# Altium schematic sheet FPGA.SchDoc: Grandmaster FPGA Connectors
size Tabloid; Author: N Smith; Revision: A; SheetNumber: 6; SheetTotal: 6; Customer: 01910
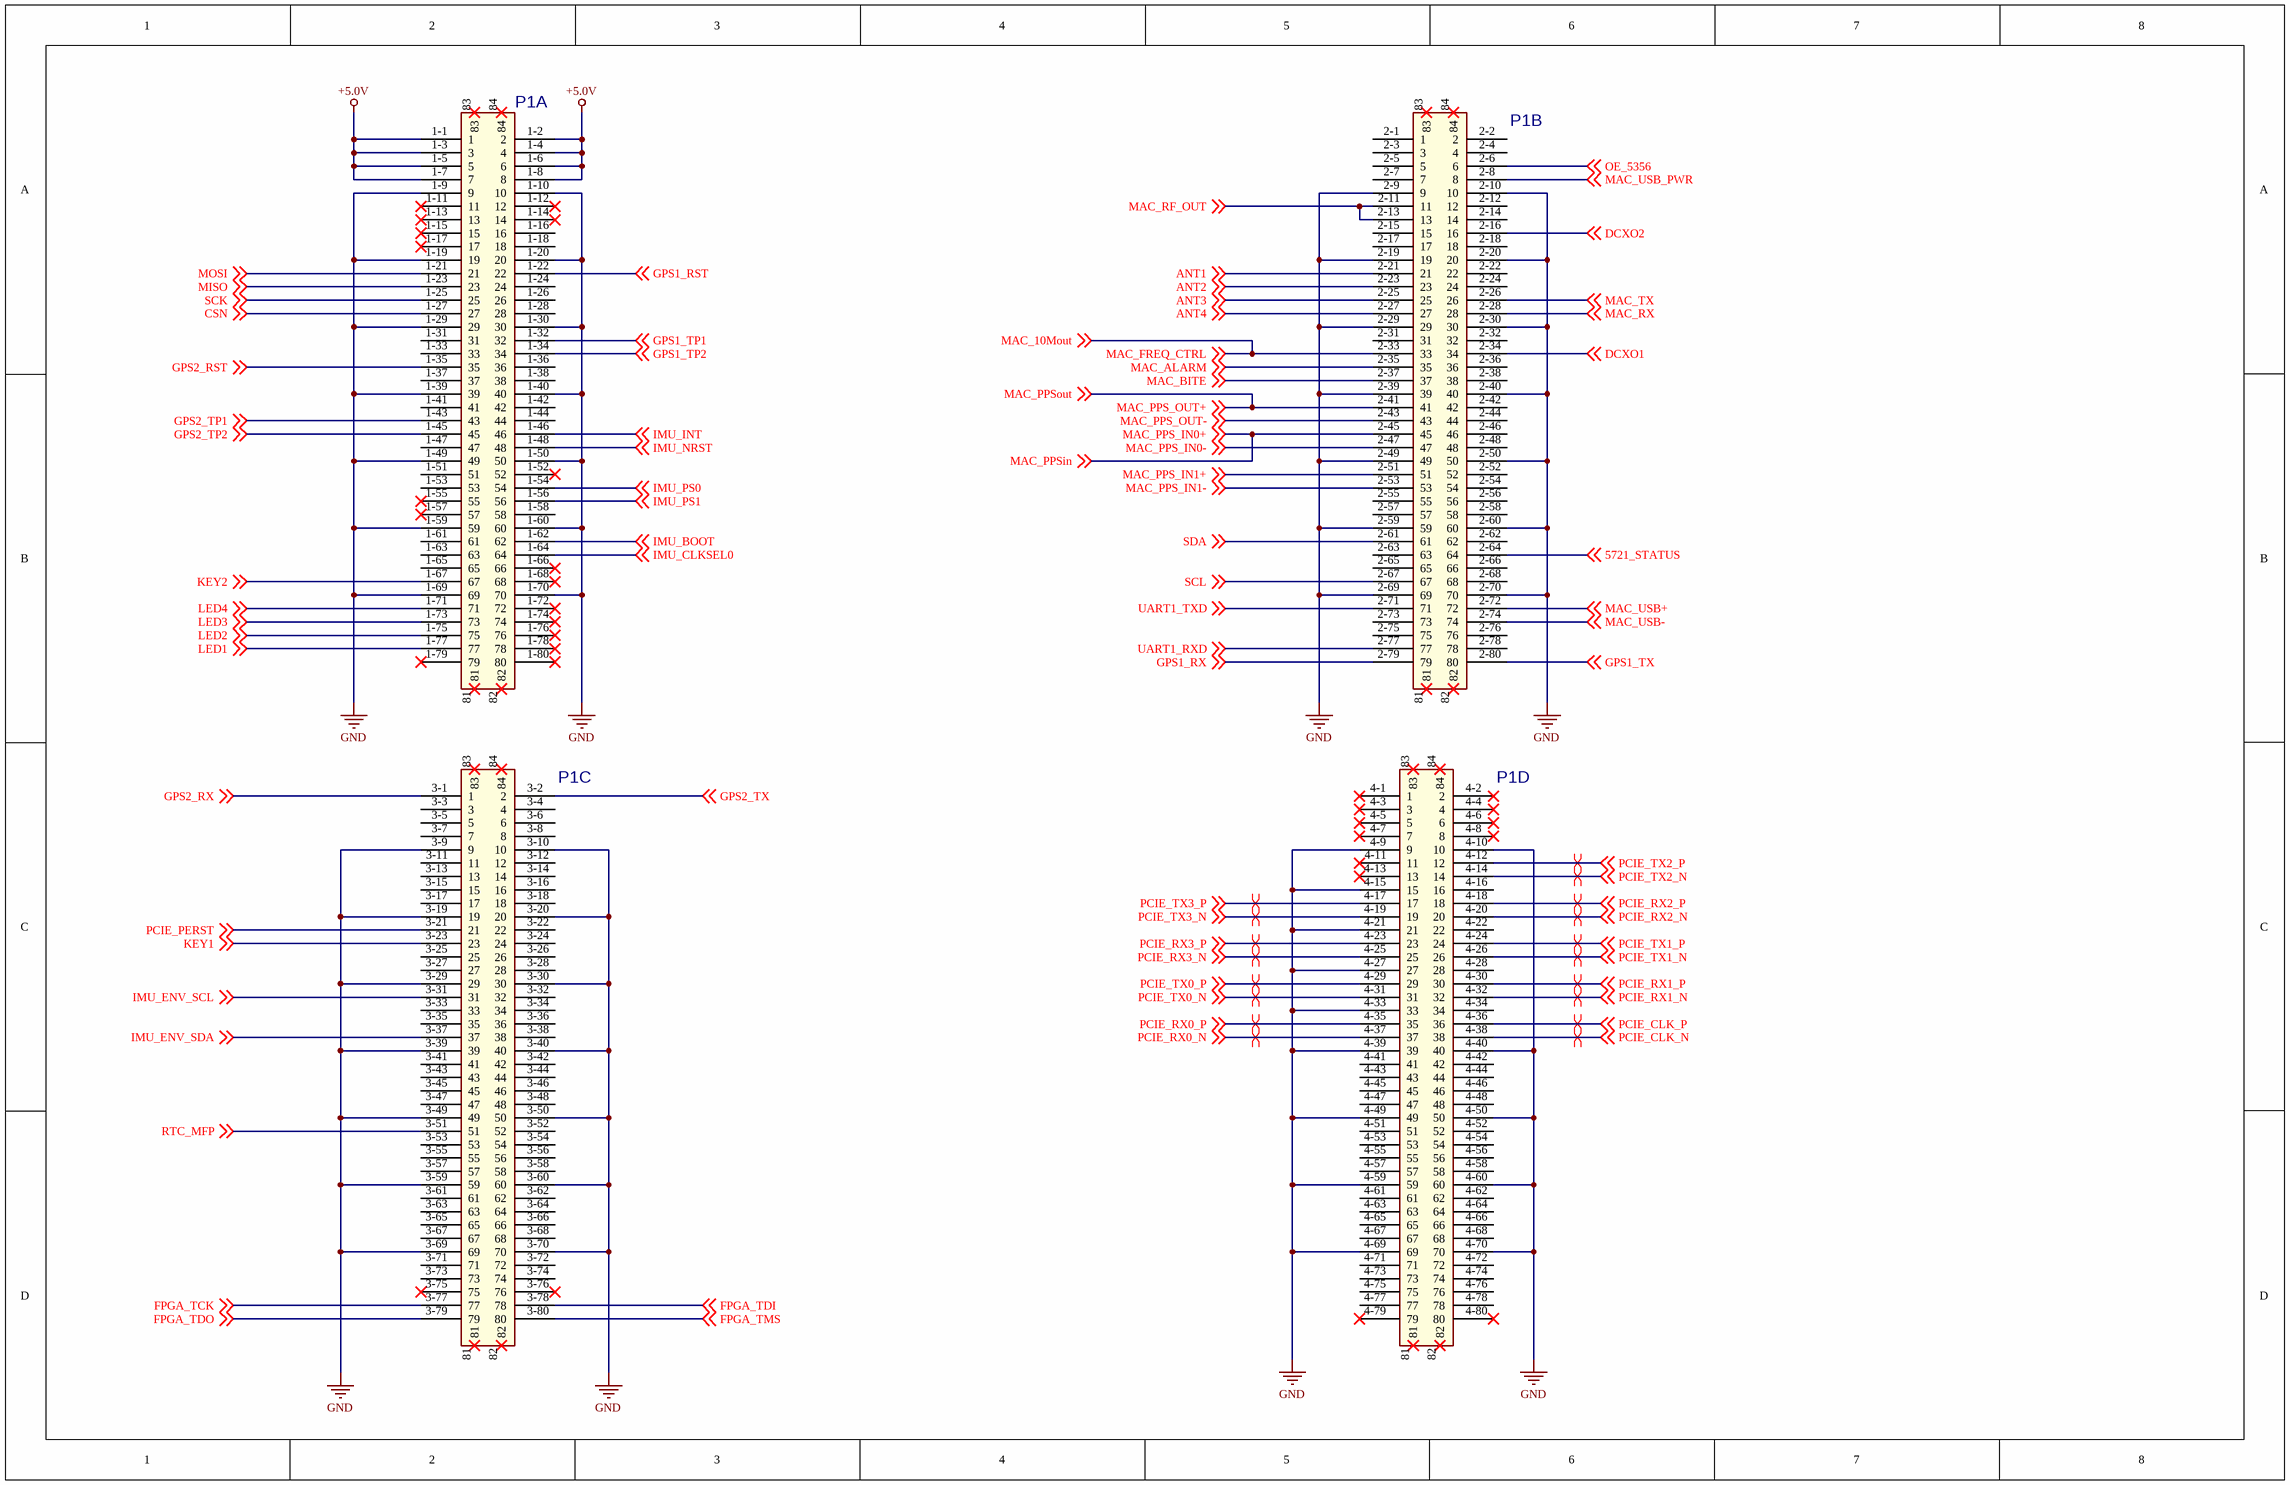
[diagram p0: FPGA.SchDoc]

## Parts
P1  MOD, FPGA, AC7100  [ALINX_FPGA]  (value not drawn)  (parts A,B,C,D of 4)

## Nets
+5.0V: P1.1-1(1) P1.1-2(2) P1.1-3(3) P1.1-4(4) P1.1-5(5) P1.1-6(6) P1.1-7(7) P1.1-8(8)
GND: P1.1-9(9) P1.1-10(10) P1.1-19(19) P1.1-20(20) P1.1-29(29) P1.1-30(30) P1.1-39(39) P1.1-40(40) P1.1-49(49) P1.1-50(50) P1.1-59(59) P1.1-60(60) P1.1-69(69) P1.1-70(70) P1.2-9(9) P1.2-10(10) P1.2-19(19) P1.2-20(20) P1.2-29(29) P1.2-30(30) P1.2-39(39) P1.2-40(40) P1.2-49(49) P1.2-50(50) P1.2-59(59) P1.2-60(60) P1.2-69(69) P1.2-70(70) P1.3-9(9) P1.3-10(10) P1.3-19(19) P1.3-20(20) P1.3-29(29) P1.3-30(30) P1.3-39(39) P1.3-40(40) P1.3-49(49) P1.3-50(50) P1.3-59(59) P1.3-60(60) P1.3-69(69) P1.3-70(70) P1.4-9(9) P1.4-10(10) P1.4-15(15) P1.4-21(21) P1.4-27(27) P1.4-33(33) P1.4-39(39) P1.4-40(40) P1.4-49(49) P1.4-50(50) P1.4-59(59) P1.4-60(60) P1.4-69(69) P1.4-70(70)
5721_STATUS: P1.2-64(64) ; off-sheet 5721_STATUS
ANT1: P1.2-21(21) ; off-sheet ANT1
ANT2: P1.2-23(23) ; off-sheet ANT2
ANT3: P1.2-25(25) ; off-sheet ANT3
ANT4: P1.2-27(27) ; off-sheet ANT4
CSN: P1.1-27(27) ; off-sheet CSN
DCXO1: P1.2-34(34) ; off-sheet DCXO1
DCXO2: P1.2-16(16) ; off-sheet DCXO2
FPGA_TCK: P1.3-77(77) ; off-sheet FPGA_TCK
FPGA_TDI: P1.3-78(78) ; off-sheet FPGA_TDI
FPGA_TDO: P1.3-79(79) ; off-sheet FPGA_TDO
FPGA_TMS: P1.3-80(80) ; off-sheet FPGA_TMS
GPS1_RST: P1.1-22(22) ; off-sheet GPS1_RST
GPS1_RX: P1.2-79(79) ; off-sheet GPS1_RX
GPS1_TP1: P1.1-32(32) ; off-sheet GPS1_TP1
GPS1_TP2: P1.1-34(34) ; off-sheet GPS1_TP2
GPS1_TX: P1.2-80(80) ; off-sheet GPS1_TX
GPS2_RST: P1.1-35(35) ; off-sheet GPS2_RST
GPS2_RX: P1.3-1(1) ; off-sheet GPS2_RX
GPS2_TP1: P1.1-43(43) ; off-sheet GPS2_TP1
GPS2_TP2: P1.1-45(45) ; off-sheet GPS2_TP2
GPS2_TX: P1.3-2(2) ; off-sheet GPS2_TX
IMU_BOOT: P1.1-62(62) ; off-sheet IMU_BOOT
IMU_CLKSEL0: P1.1-64(64) ; off-sheet IMU_CLKSEL0
IMU_ENV_SCL: P1.3-31(31) ; off-sheet IMU_ENV_SCL
IMU_ENV_SDA: P1.3-37(37) ; off-sheet IMU_ENV_SDA
IMU_INT: P1.1-46(46) ; off-sheet IMU_INT
IMU_NRST: P1.1-48(48) ; off-sheet IMU_NRST
IMU_PS0: P1.1-54(54) ; off-sheet IMU_PS0
IMU_PS1: P1.1-56(56) ; off-sheet IMU_PS1
KEY1: P1.3-23(23) ; off-sheet KEY1
KEY2: P1.1-67(67) ; off-sheet KEY2
LED1: P1.1-77(77) ; off-sheet LED1
LED2: P1.1-75(75) ; off-sheet LED2
LED3: P1.1-73(73) ; off-sheet LED3
LED4: P1.1-71(71) ; off-sheet LED4
MAC_10Mout: P1.2-33(33) ; off-sheet MAC_FREQ_CTRL, off-sheet MAC_10Mout  [also labelled MAC_FREQ_CTRL]
MAC_ALARM: P1.2-35(35) ; off-sheet MAC_ALARM
MAC_BITE: P1.2-37(37) ; off-sheet MAC_BITE
MAC_PPS_IN0+: P1.2-45(45) ; off-sheet MAC_PPS_IN0+, off-sheet MAC_PPSin  [also labelled MAC_PPSin]
MAC_PPS_IN0-: P1.2-47(47) ; off-sheet MAC_PPS_IN0-
MAC_PPS_IN1+: P1.2-51(51) ; off-sheet MAC_PPS_IN1+
MAC_PPS_IN1-: P1.2-53(53) ; off-sheet MAC_PPS_IN1-
MAC_PPS_OUT+: P1.2-41(41) ; off-sheet MAC_PPS_OUT+, off-sheet MAC_PPSout  [also labelled MAC_PPSout]
MAC_PPS_OUT-: P1.2-43(43) ; off-sheet MAC_PPS_OUT-
MAC_RF_OUT: P1.2-11(11) P1.2-13(13) ; off-sheet MAC_RF_OUT
MAC_RX: P1.2-28(28) ; off-sheet MAC_RX
MAC_TX: P1.2-26(26) ; off-sheet MAC_TX
MAC_USB+: P1.2-72(72) ; off-sheet MAC_USB+
MAC_USB-: P1.2-74(74) ; off-sheet MAC_USB-
MAC_USB_PWR: P1.2-8(8) ; off-sheet MAC_USB_PWR
MISO: P1.1-23(23) ; off-sheet MISO
MOSI: P1.1-21(21) ; off-sheet MOSI
OE_5356: P1.2-6(6) ; off-sheet OE_5356
PCIE_CLK_N: P1.4-38(38) ; off-sheet PCIE_CLK_N
PCIE_CLK_P: P1.4-36(36) ; off-sheet PCIE_CLK_P
PCIE_PERST: P1.3-21(21) ; off-sheet PCIE_PERST
PCIE_RX0_N: P1.4-37(37) ; off-sheet PCIE_RX0_N
PCIE_RX0_P: P1.4-35(35) ; off-sheet PCIE_RX0_P
PCIE_RX1_N: P1.4-32(32) ; off-sheet PCIE_RX1_N
PCIE_RX1_P: P1.4-30(30) ; off-sheet PCIE_RX1_P
PCIE_RX2_N: P1.4-20(20) ; off-sheet PCIE_RX2_N
PCIE_RX2_P: P1.4-18(18) ; off-sheet PCIE_RX2_P
PCIE_RX3_N: P1.4-25(25) ; off-sheet PCIE_RX3_N
PCIE_RX3_P: P1.4-23(23) ; off-sheet PCIE_RX3_P
PCIE_TX0_N: P1.4-31(31) ; off-sheet PCIE_TX0_N
PCIE_TX0_P: P1.4-29(29) ; off-sheet PCIE_TX0_P
PCIE_TX1_N: P1.4-26(26) ; off-sheet PCIE_TX1_N
PCIE_TX1_P: P1.4-24(24) ; off-sheet PCIE_TX1_P
PCIE_TX2_N: P1.4-14(14) ; off-sheet PCIE_TX2_N
PCIE_TX2_P: P1.4-12(12) ; off-sheet PCIE_TX2_P
PCIE_TX3_N: P1.4-19(19) ; off-sheet PCIE_TX3_N
PCIE_TX3_P: P1.4-17(17) ; off-sheet PCIE_TX3_P
RTC_MFP: P1.3-51(51) ; off-sheet RTC_MFP
SCK: P1.1-25(25) ; off-sheet SCK
SCL: P1.2-67(67) ; off-sheet SCL
SDA: P1.2-61(61) ; off-sheet SDA
UART1_RXD: P1.2-77(77) ; off-sheet UART1_RXD
UART1_TXD: P1.2-71(71) ; off-sheet UART1_TXD

Not connected (* = marked no-connect by the designer): P1 1-11(11)* 1-12(12)* 1-13(13)* 1-14(14)* 1-15(15)* 1-16(16) 1-17(17)* 1-18(18) 1-24(24) 1-26(26) 1-28(28) 1-31(31) 1-33(33) 1-36(36) 1-37(37) 1-38(38) 1-41(41) 1-42(42) 1-44(44) 1-47(47) 1-51(51) 1-52(52)* 1-53(53) 1-55(55)* 1-57(57)* 1-58(58) 1-61(61) 1-63(63) 1-65(65) 1-66(66)* 1-68(68)* 1-72(72)* 1-74(74)* 1-76(76)* 1-78(78)* 1-79(79)* 1-80(80)* 2-1(1) 2-2(2) 2-3(3) 2-4(4) 2-5(5) 2-7(7) 2-12(12) 2-14(14) 2-15(15) 2-17(17) 2-18(18) 2-22(22) 2-24(24) 2-31(31) 2-32(32) 2-36(36) 2-38(38) 2-42(42) 2-44(44) 2-46(46) 2-48(48) 2-52(52) 2-54(54) 2-55(55) 2-56(56) 2-57(57) 2-58(58) 2-62(62) 2-63(63) 2-65(65) 2-66(66) 2-68(68) 2-73(73) 2-75(75) 2-76(76) 2-78(78) 3-3(3) 3-4(4) 3-5(5) 3-6(6) 3-7(7) 3-8(8) 3-11(11) 3-12(12) 3-13(13) 3-14(14) 3-15(15) 3-16(16) 3-17(17) 3-18(18) 3-22(22) 3-24(24) 3-25(25) 3-26(26) 3-27(27) 3-28(28) 3-32(32) 3-33(33) 3-34(34) 3-35(35) 3-36(36) 3-38(38) 3-41(41) 3-42(42) 3-43(43) 3-44(44) 3-45(45) 3-46(46) 3-47(47) 3-48(48) 3-52(52) 3-53(53) 3-54(54) 3-55(55) 3-56(56) 3-57(57) 3-58(58) 3-61(61) 3-62(62) 3-63(63) 3-64(64) 3-65(65) 3-66(66) 3-67(67) 3-68(68) 3-71(71) 3-72(72) 3-73(73) 3-74(74) 3-75(75)* 3-76(76)* 4-1(1)* 4-2(2)* 4-3(3)* 4-4(4)* 4-5(5)* 4-6(6)* 4-7(7)* 4-8(8)* 4-11(11)* 4-13(13)* 4-16(16) 4-22(22) 4-28(28) 4-34(34) 4-41(41) 4-42(42) 4-43(43) 4-44(44) 4-45(45) 4-46(46) 4-47(47) 4-48(48) 4-51(51) 4-52(52) 4-53(53) 4-54(54) 4-55(55) 4-56(56) 4-57(57) 4-58(58) 4-61(61) 4-62(62) 4-63(63) 4-64(64) 4-65(65) 4-66(66) 4-67(67) 4-68(68) 4-71(71) 4-72(72) 4-73(73) 4-74(74) 4-75(75) 4-76(76) 4-77(77) 4-78(78) 4-79(79)* 4-80(80)* 81* 82* 83* 84*

## Layout directives
differential pair: PCIE_CLK_N, PCIE_CLK_P, PCIE_RX0_N, PCIE_RX0_P, PCIE_RX1_N, PCIE_RX1_P, PCIE_RX2_N, PCIE_RX2_P, PCIE_RX3_N, PCIE_RX3_P, PCIE_TX0_N, PCIE_TX0_P, PCIE_TX1_N, PCIE_TX1_P, PCIE_TX2_N, PCIE_TX2_P, PCIE_TX3_N, PCIE_TX3_P

## Library data of the parts
P1 = ALINX_FPGA: MFG PART NUM: AXK680337YG; VALENTIUM PART NUM: <VALENTIUM>; MFG Name: Panasonic; MAXTEMP: C; P1: VERT; P2: .05; P3: ALIGN, LOCK; DESC: CONN, HDR, 2X40, VERT, .05, ALIGN, SMT, TFM-1XX; MODIFY DATE: 10/10/2013; CATEGORY: MOD, FPGA; MINTEMP: C; SIZE: SMT